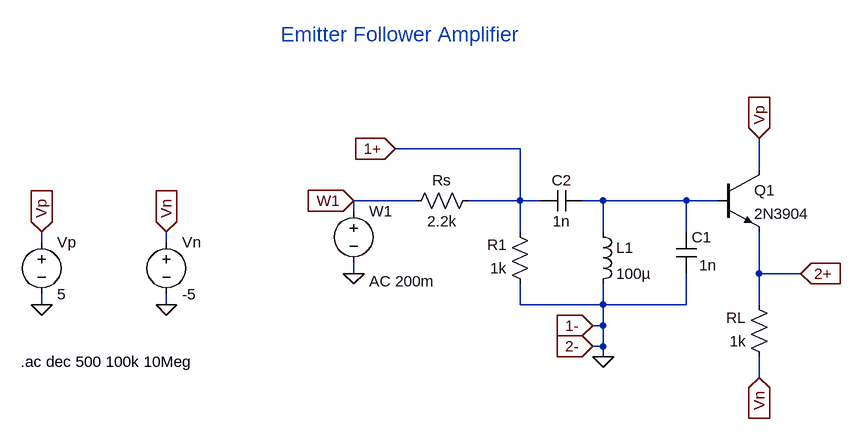
[diagram p0: schematic ef_tuned_amplifier.asc]
ef_tuned_amplifier.asc, the LTspice schematic file:
Version 4
SHEET 1 880 680
WIRE 144 -16 -48 -16
WIRE 512 16 512 -32
WIRE -16 64 -112 64
WIRE 144 64 144 -16
WIRE 144 64 64 64
WIRE 176 64 144 64
WIRE 272 64 240 64
WIRE 400 64 272 64
WIRE 448 64 400 64
WIRE -112 80 -112 64
WIRE 144 112 144 64
WIRE 272 112 272 64
WIRE 400 112 400 64
WIRE -592 128 -592 112
WIRE -400 128 -400 112
WIRE -112 176 -112 160
WIRE 512 176 512 112
WIRE 576 176 512 176
WIRE -592 224 -592 208
WIRE -400 224 -400 208
WIRE 144 224 144 192
WIRE 272 224 272 192
WIRE 272 224 144 224
WIRE 400 224 400 176
WIRE 400 224 272 224
WIRE 512 224 512 176
WIRE 272 256 272 224
WIRE 272 256 256 256
WIRE 272 288 272 256
WIRE 272 288 256 288
WIRE 272 304 272 288
WIRE 512 336 512 304
FLAG 512 -32 Vp
IOPIN 512 -32 In
FLAG 512 336 Vn
IOPIN 512 336 In
FLAG -112 64 W1
IOPIN -112 64 In
FLAG -48 -16 1+
IOPIN -48 -16 In
FLAG 256 256 1-
IOPIN 256 256 In
FLAG 256 288 2-
IOPIN 256 288 In
FLAG 576 176 2+
IOPIN 576 176 In
FLAG 272 304 0
FLAG -592 224 0
FLAG -400 224 0
FLAG -400 112 Vn
IOPIN -400 112 In
FLAG -592 112 Vp
IOPIN -592 112 In
FLAG -112 176 0
SYMBOL res 80 48 R90
WINDOW 0 0 56 VBottom 2
WINDOW 3 32 56 VTop 2
SYMATTR InstName Rs
SYMATTR Value 2.2k
SYMBOL res 160 208 R180
WINDOW 0 36 76 Left 2
WINDOW 3 36 40 Left 2
SYMATTR InstName R1
SYMATTR Value 1k
SYMBOL res 528 320 R180
WINDOW 0 36 76 Left 2
WINDOW 3 36 40 Left 2
SYMATTR InstName RL
SYMATTR Value 1k
SYMBOL cap 384 112 R0
WINDOW 3 36 51 Left 2
SYMATTR Value 1n
SYMATTR InstName C1
SYMBOL cap 240 48 R90
WINDOW 0 0 32 VBottom 2
WINDOW 3 32 32 VTop 2
SYMATTR InstName C2
SYMATTR Value 1n
SYMBOL npn 448 16 R0
SYMATTR InstName Q1
SYMATTR Value 2N3904
SYMBOL ind 256 96 R0
SYMATTR InstName L1
SYMATTR Value 100µ
SYMBOL voltage -592 112 R0
WINDOW 123 0 0 Left 0
WINDOW 39 0 0 Left 0
SYMATTR InstName Vp
SYMATTR Value 5
SYMBOL voltage -400 112 R0
WINDOW 123 0 0 Left 0
WINDOW 39 0 0 Left 0
SYMATTR InstName Vn
SYMATTR Value -5
SYMBOL voltage -112 64 R0
WINDOW 123 24 124 Left 2
WINDOW 39 0 0 Left 0
SYMATTR Value2 AC 200m
SYMATTR InstName W1
SYMATTR Value ""
TEXT -224 -192 Left 3 ;Emitter Follower Amplifier
TEXT -624 312 Left 2 !.ac dec 500 100k 10Meg

The netlist it stands for:
* ef_tuned_amplifier.asc
Rs 1+ W1 2.2k
R1 0 1+ 1k
RL Vn 2+ 1k
C1 N001 0 1n
C2 N001 1+ 1n
Q1 Vp N001 2+ 0 2N3904
L1 N001 0 100µ
Vp Vp 0 5
Vn Vn 0 -5
V§W1 W1 0 AC 200m
.model NPN NPN
.model PNP PNP
.lib standard.bjt
* Emitter Follower Amplifier
.ac dec 500 100k 10Meg
.backanno
.end